# Altium schematic sheet Control System.SchDoc
size A4
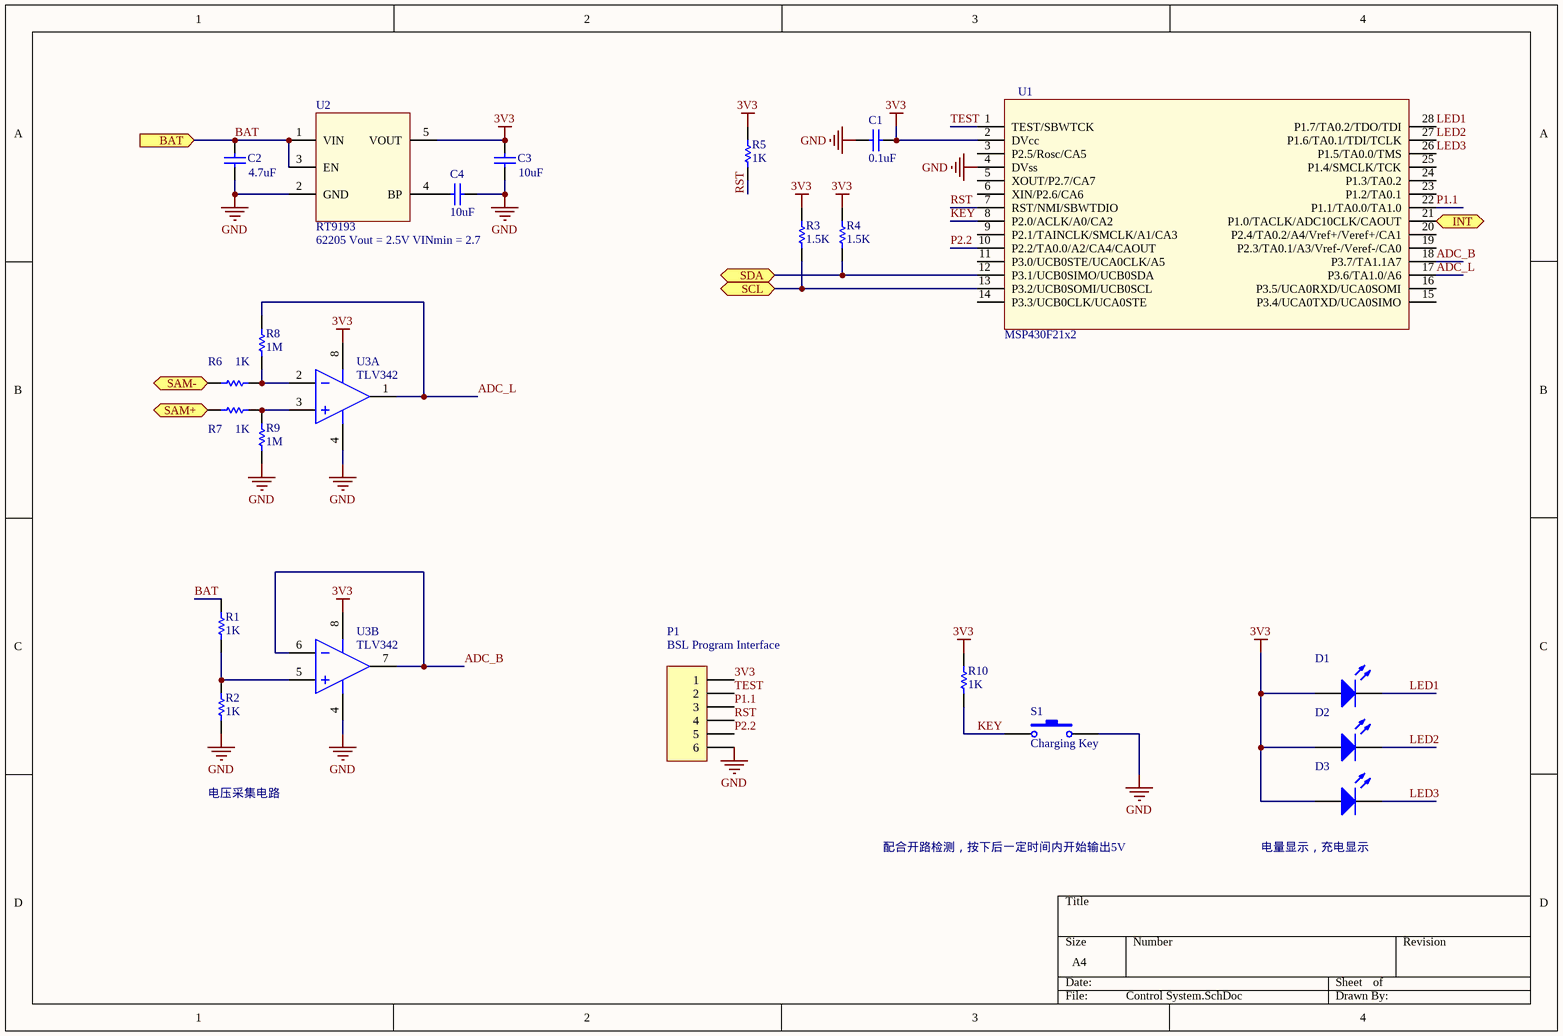
[diagram p0: Control System.SchDoc]

## Parts
C1  value 0.1uF  [D0603]  (hidden comment: 0603)
C2  value 4.7uF  [D0603]  (hidden comment: 0603)
C3  value 10uF  [D0603]  (hidden comment: 0603)
C4  value 10uF  [D0603]  (hidden comment: 0603)
D1  0603/0805  [D0805_Diode]  (value not drawn)
D2  0603/0805  [D0805_Diode]  (value not drawn)
D3  0603/0805  [D0805_Diode]  (value not drawn)
P1  BSL Program Interface  [HDR1X6]
R1  value 1K  [D0603]  (hidden comment: 0603)
R2  value 1K  [D0603]  (hidden comment: 0603)
R3  value 1.5K  [D0603]  (hidden comment: 0603)
R4  value 1.5K  [D0603]  (hidden comment: 0603)
R5  value 1K  [D0603]  (hidden comment: 0603)
R6  value 1K  [D0603]  (hidden comment: 0603)
R7  value 1K  [D0603]  (hidden comment: 0603)
R8  value 1M  [D0603]  (hidden comment: 0603)
R9  value 1M  [D0603]  (hidden comment: 0603)
R10  value 1K  [D0603]  (hidden comment: 0603)
S1  Charging Key  [SW_A]
U1  MSP430F21x2  [TSSOP28]
U2  RT9193  [SC70-5]
U3  TLV342  [TSSOP8]  (parts A,B of 2)

## Ports
BAT (in), INT, SAM+, SAM-, SCL, SDA

## Nets
3V3: C1.2 C3.2 D1.1(A) D2.1(A) D3.1(A) P1.1 R3.2 R4.2 R5.1 R10.1 U1.2(DVcc) U2.5(VOUT) U3.8(V+)
GND: C1.1 C2.1 C3.1 C4.1 P1.6 R2.1 R9.1 S1.2 U1.4(DVss) U2.2(GND) U3.4(V-)
ADC_B: U1.18(P3.7/TA1.1A7) U3.6(IN-) U3.7(OUT)
ADC_L: R8.2 U1.17(P3.6/TA1.0/A6) U3.1(OUT)
BAT: C2.2 R1.2 U2.1(VIN) U2.3(EN) ; port BAT
INT: U1.21(P1.0/TACLK/ADC10CLK/CAOUT) ; port INT
KEY: R10.2 S1.1 U1.8(P2.0/ACLK/A0/CA2)
LED1: D1.2(K) U1.28(P1.7/TA0.2/TDO/TDI)
LED2: D2.2(K) U1.27(P1.6/TA0.1/TDI/TCLK)
LED3: D3.2(K) U1.26(P1.5/TA0.0/TMS)
P1.1: P1.3 U1.22(P1.1/TA0.0/TA1.0)
P2.2: P1.5 U1.10(P2.2/TA0.0/A2/CA4/CAOUT)
RST: P1.4 R5.2 U1.7(RST/NMI/SBWTDIO)
SAM+: R7.1 ; port SAM+
SAM-: R6.2 ; port SAM-
SCL: R3.1 U1.13(P3.2/UCB0SOMI/UCB0SCL) ; port SCL
SDA: R4.1 U1.12(P3.1/UCB0SIMO/UCB0SDA) ; port SDA
TEST: P1.2 U1.1(TEST/SBWTCK)
NetC4_2: C4.2 U2.4(BP)
NetR1_1: R1.1 R2.2 U3.5(IN+)
NetR6_1: R6.1 R8.1 U3.2(IN-)
NetR7_2: R7.2 R9.2 U3.3(IN+)

Not connected (* = marked no-connect by the designer): U1 3(P2.5/Rosc/CA5) 5(XOUT/P2.7/CA7) 6(XIN/P2.6/CA6) 9(P2.1/TAINCLK/SMCLK/A1/CA3) 11(P3.0/UCB0STE/UCA0CLK/A5) 14(P3.3/UCB0CLK/UCA0STE) 15(P3.4/UCA0TXD/UCA0SIMO) 16(P3.5/UCA0RXD/UCA0SOMI) 19(P2.3/TA0.1/A3/Vref-/Veref-/CA0) 20(P2.4/TA0.2/A4/Vref+/Veref+/CA1) 23(P1.2/TA0.1) 24(P1.3/TA0.2) 25(P1.4/SMCLK/TCK)

## Notes on the sheet
- 62205 Vout = 2.5V VINmin = 2.7
- 电压采集电路
- 配合开路检测，按下后一定时间内开始输出5V
- (near D3) 电量显示，充电显示

## Library data of the parts
C1-C4 = Cap: Capacitor; Published: 8-Jun-2000; LatestRevisionDate: 17-Jul-2002; LatestRevisionNote: Re-released for DXP Platform.; PackageReference: RAD-0.3; Publisher: Altium Limited; PackageDescription: Radial Cap, Thru-Hole; 2 Leads; 0.3 in Pin Spacing
D1-D3 = LED0: Typical INFRARED GaAs LED; Published: 8-Jun-2000; LatestRevisionDate: 08-Jul-2005; LatestRevisionNote: Mech Layer 1 removed.; PackageReference: LED-0; Publisher: Altium Limited; PackageDescription: LED; 2 Leads
P1 = Header 6: Header, 6-Pin; LatestRevisionDate: 17-Jul-2002; LatestRevisionNote: Re-released for DXP Platform.; Publisher: Altium Limited
R1-R10 = Res1: Resistor; Published: 8-Jun-2000; LatestRevisionDate: 17-Jul-2002; LatestRevisionNote: Re-released for DXP Platform.; PackageReference: AXIAL-0.3; Publisher: Altium Limited; PackageDescription: Axial Device, Thru-Hole; 2 Leads; 0.3 in Pin Spacing
S1 = SW-PB: Switch; Published: 24-Mar-1999; LatestRevisionDate: 17-Jul-2002; LatestRevisionNote: Re-released for DXP Platform.; PackageReference: SPST-2; Publisher: Altium Limited; PackageDescription: Switch; 2 Leads
U1 = MSP430F21x2_PW
U2 = RT9193: 3V3 Voltage Regulator
U3 = LPV358: LPV358 Op Amp